# Altium schematic sheet exhaust_gas_temp_oxy.SchDoc
size A4; SheetNumber: 8; SheetTotal: 8
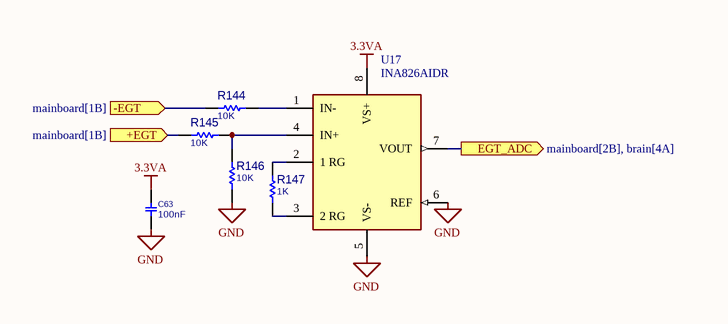
[diagram p0: exhaust_gas_temp_oxy.SchDoc]

## Parts
C63  100nF  [C0805]
R144  10K  [R0805]
R145  10K  [R0805]
R146  10K  [R0805]
R147  1K  [R0805]
U17  INA826AIDR  [SOIC-8]

## Ports
+EGT (in, see mainboard[1B]), -EGT (in, see mainboard[1B]), EGT_ADC (out, see mainboard[2B], brain[4A])

## Nets
3.3VA: C63.2 U17.8(VS+)
GND: C63.1 R146.1 U17.5(VS-) U17.6(REF)
+EGT: R145.1 ; port +EGT
-EGT: R144.2 ; port -EGT
EGT_ADC: U17.7(VOUT) ; port EGT_ADC
NetR144_1: R144.1 U17.1(IN-)
NetR145_2: R145.2 R146.2 U17.4(IN+)
NetR147_1: R147.1 U17.3(2_RG)
NetR147_2: R147.2 U17.2(1_RG)

## Library data of the parts
C63 = CAP_SMD_MLCC_0805: CAP, MLCC; PARAM: -, -%; MANF_P#: MANF_PART#; PARAM2: -V; PRICE: 100= 1$; MANF: -; ASSEMBLY: ASSEMBLY; VALUE: 100nF
R144-R147 = RES_SMD_0805: RESISTOR, SMD; PARAM: -W; DESC: DESCRIPTION; DIST#: MOUSER; PARAM2: 1%; MANF_P#: -; MANF: -; ASSEMBLY: ASSEMBLY; PRICE: 100= 0.5$
  R144-R146: VALUE: 10K
  R147: VALUE: 1K
U17 = INA826: IC INST AMP 1 CIRCUIT 8SOIC; Number of Circuits: 1; Common Mode Rejection Ratio: 84dB; Power Supply Rejection Ratio (PSRR): 100dB; Input Voltage Noise Density: 18nV/sqrt Hz; Input Resistance: 100kR; Output Current per Channel: 16mA; Input Offset Voltage (Vos): 150uV; Bandwidth: 1MHz; Supply Current: 200uA; Input Bias Current: 65nA; Max Dual Supply Voltage: 18V; Max Supply Voltage: 36V; Min Supply Voltage: 2.7V; Voltage Gain: 60dB; Slew Rate: 1V/µs; Min Dual Supply Voltage: 1.35V; Number of Elements: 1; Series: -; Number of Pins: 8; Lead Free: Lead Free; Output Current: 16mA; REACH SVHC: No SVHC; Min Operating Temperature: -40°C; Quiescent Current: 200uA; Nominal Supply Current: 200uA; Max Operating Temperature: 125°C; RoHS Compliant: Yes; Case/Package: D; -3db Bandwidth: 1MHz; Radiation Hardening: No; Operating Supply Current: 200uA; Packaging: Tape and Reel; Package Quantity: 1; Number of Amplifiers: 1; Number of Channels: 1